# EasyEDA Pro project pcb_file.epro

# Schematic Schematic1
Board Name: Board1; Create Date: 2025-12-25; Page Name: P1; Project Name: 雷达扫描课设2.1; Schematic Name: Schematic1; Update Date: 2026-03-30; Company: 嘉立创EDA; Page Size: A4; Version: V1.0
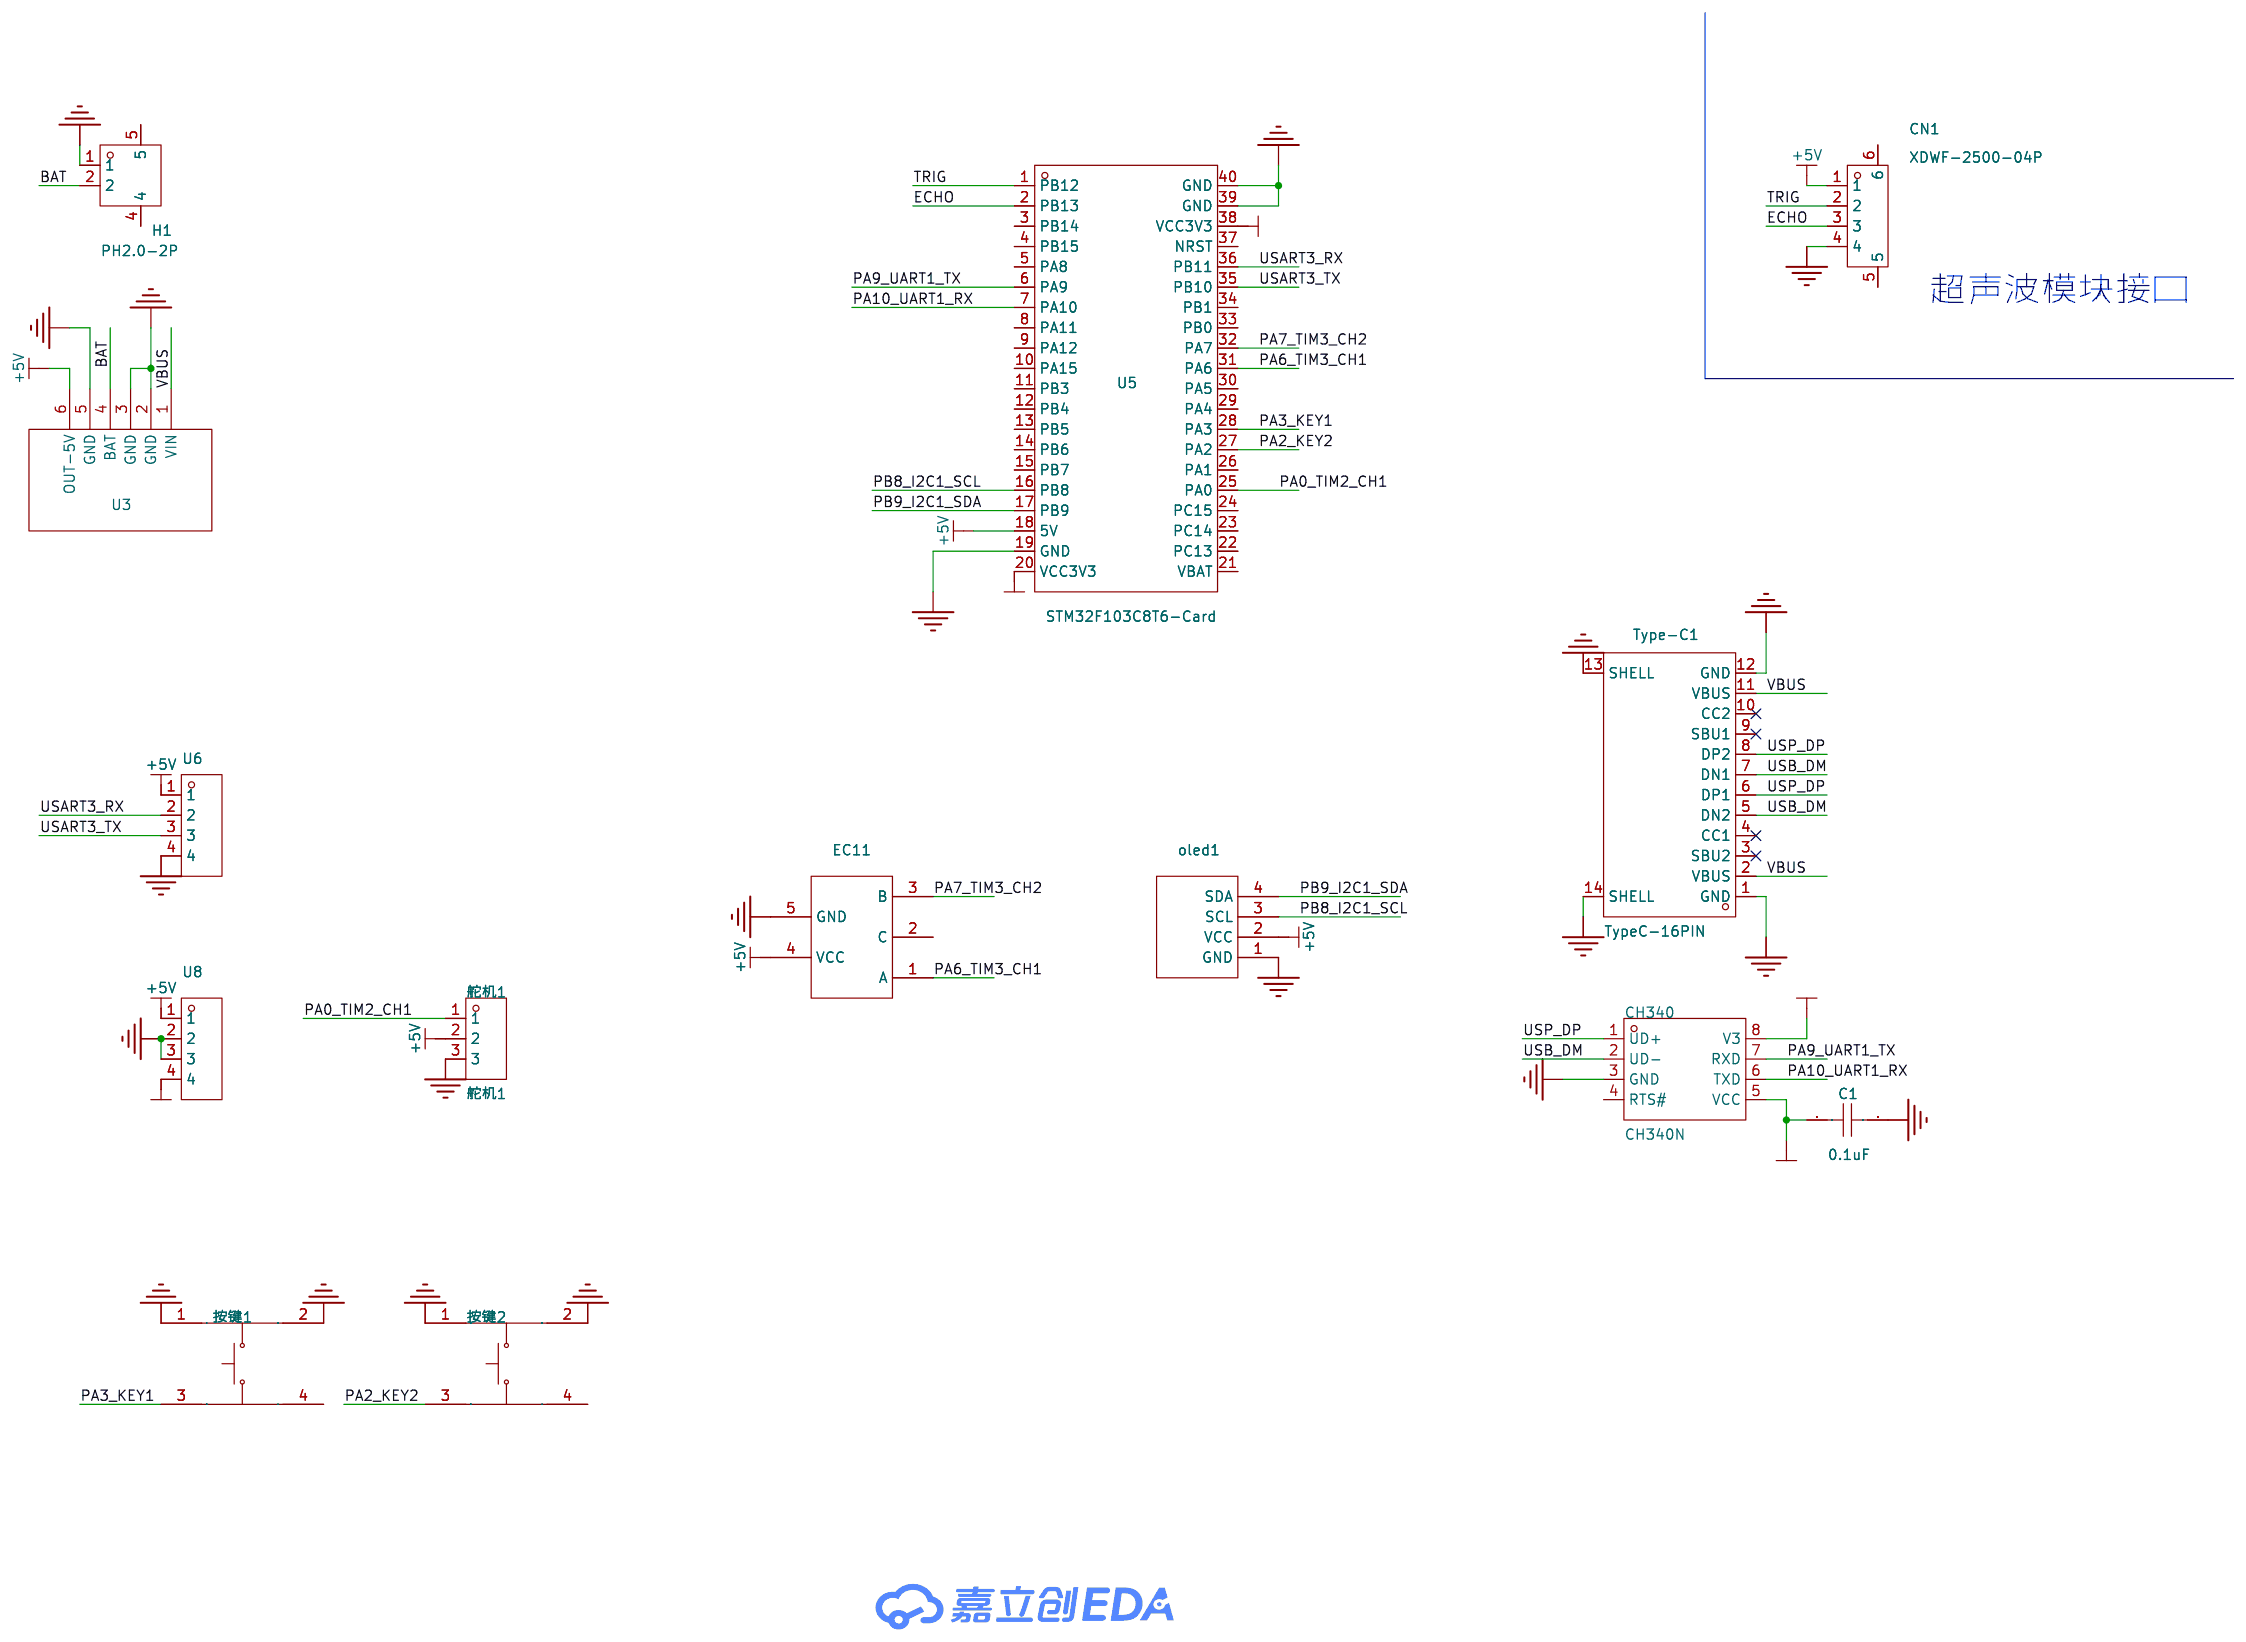
[diagram p0: schematic sheet]

## Parts
C1  0.1uF  [C0805]
CH340  CH340N  [SOP-8_L4.9-W3.9-P1.27-LS6.0-BL]
CN1  XDWF-2500-04P  [CONN-SMD_4P-P2.54_MXXH-2.54-04P-WT1-0-A]
EC11  -  [EC11封装]
H1  PH2.0-2P  [CONN-SMD_2P-P2.00_XUNPU_WAFER-PH2.0-2PWB]
oled1  -  [0.96 oled]
Type-C1  TypeC-16PIN  [USB-C-SMD_TYPE-C-6PIN-2MD-073]
U3  -  [充电板]
U5  STM32F103C8T6-Card  [CONN-TH_L53.3-W22.9_STM32F103C8T6-CARD]
U6  FG-PM2.54-1-04P-H8.5  [CONN-TH_FG-PM2.54-1-04P-H8.5]
U8  FG-PM2.54-1-04P-H8.5  [CONN-TH_FG-PM2.54-1-04P-H8.5]
按键1  TS5215A 250gf  [SW-SMD_4P-L5.2-W5.2-P3.70-LS6.4]
按键2  TS5215A 250gf  [SW-SMD_4P-L5.2-W5.2-P3.70-LS6.4]
舵机1  舵机1  [HDR-TH_3P-P2.54-V-M]

## Library data of the parts
C1 = CL21A226MAQNNNE: 容值:22uF;精度:±20%;额定电压:25V;材质(温度系数):X5R;; LCSC Part Name: 22uF ±20% 25V; Supplier Part: C45783; Manufacturer: SAMSUNG(三星); Supplier Footprint: 0805; JLCPCB Part Class: 基础库; Datasheet: https://atta.szlcsc.com/upload/public/pdf/source/20160218/1457707763339.pdf; Supplier: LCSC; Tolerance: ±20%; Voltage Rated: 25V; Temperature Coefficient: X5R
CH340 = CH340N: LCSC Part Name: USB转串口芯片 CH340; Supplier Part: C2977777; Manufacturer: WCH(南京沁恒); Supplier Footprint: SOP-8; JLCPCB Part Class: 扩展库; Datasheet: https://atta.szlcsc.com/upload/public/pdf/source/20230530/6E401E9554E9F5311886CC8B3F89B62E.pdf; Supplier: LCSC
CN1 = XDWF-2500-04P: 间距:2.54mm;安装方式:卧贴;参考系列:XH;总PIN数:4P;额定电流:4A;工作温度范围:-40℃~+85℃;; LCSC Part Name: 间距:2.54mm 卧贴 系列:XH; Supplier Part: C19723931; Manufacturer: LX(连欣科技); Supplier Footprint: SMD,P=2.5mm,卧贴; JLCPCB Part Class: 扩展库; Datasheet: https://atta.szlcsc.com/upload/public/pdf/source/20231222/6CB0E40CA6FFE63C5D87C69622E580AB.pdf; Supplier: LCSC; Pitch: 2.54mm; Mounting Style: 卧贴; Reference Series: XH; Number of Pins: 4P; Current Rating (Max): 4A; Operating Temperature Range: -40℃~+85℃
EC11 = EC11
H1 = WAFER-PH2.0-2PWB: 插针结构:1x2P;间距:2mm;安装方式:卧贴;总PIN数:2P;排数:1;每排PIN数:2;额定电流:2A;工作温度范围:-25℃~+85℃;; LCSC Part Name: 1x2P 间距:2mm 卧贴; Supplier Part: C3029440; Manufacturer: XUNPU(讯普); Supplier Footprint: SMD,P=2mm,卧贴; JLCPCB Part Class: 扩展库; Datasheet: https://atta.szlcsc.com/upload/public/pdf/source/20220527/83903C18429EFE4C9EEE8C529A248431.pdf; Supplier: LCSC; Pins Structure: 1x2P; Pitch: 2mm; Mounting Style: 卧贴; Number of Pins: 2P; Number of Rows: 1; Number of PINs Per Row: 2; Current Rating (Max): 2A; Operating Temperature Range: -25℃~+85℃
oled1 = oled
Type-C1 = TypeC-16PIN: Supplier Part: C9900016187; JLCPCB Part Class: 扩展库; Supplier: LCSC
U3 = 充电板
U5 = STM32F103C8T6-Card: Supplier Part: C9900077949; Supplier Footprint: 插件; Supplier: LCSC
U6 U8 = FG-PM2.54-1-04P-H8.5: 插孔结构:1x4P;间距:2.54mm;圆孔/方孔:方孔;安装方式:直插;排数:单排;总孔位数:4P;额定电流:3A;插孔方向:顶部;塑高:8.5mm;触头材质:黄铜;; LCSC Part Name: 间距:2.54mm 1x4P 直插; Supplier Part: C25687186; Manufacturer: FG(富港); Supplier Footprint: 插件,P=2.54mm; JLCPCB Part Class: 扩展库; Datasheet: https://item.szlcsc.com/datasheet/FG-PM2.54-1-04P-H8.5/27570630.html; Supplier: LCSC; Holes Structure: 1x4P; Pitch: 2.54mm; Circular Hole / Square Hole: 方孔; Mounting Type: 直插; Number of Rows: 单排; Number of Positions: 4P; Current Rating: 3A; Holes Direction: 顶部; Insulation Height: 8.5mm; Contact Material: 黄铜
按键1 按键2 = TS5215A 250gf: 电路结构:单刀单掷;按钮形状:圆形按钮;安装方式:立贴;开关长度:5.2mm;开关宽度:5.2mm;触点电流:50mA;额定电压(DC):12V;带灯:-;机械寿命:-;; LCSC Part Name: 轻触开关 5.2*5.2*1.5mm 250gf 4*4铜头; Supplier Part: C388295; Manufacturer: SHOU HAN(首韩); Supplier Footprint: SMD; JLCPCB Part Class: 扩展库; Datasheet: https://atta.szlcsc.com/upload/public/pdf/source/20190424/C388295_31A82B96127B687D36F6ABA2DD1EA95B.pdf; Supplier: LCSC; Circuit: 单刀单掷; Actuator Style: 圆形按钮; Mounting Style: 立贴; Switch Length: 5.2mm; Switch Width: 5.2mm; Contact Current: 50mA; Voltage Rating (DC): 12V
舵机1 = PZ254V-11-03P: 插针结构:1x3P;间距:2.54mm;行距:-;圆针/方针:方针;安装方式:直插;排数:单排;总PIN位数:3P;额定电流:3A;额定电压:250V;配合针长度:6mm;塑高:2.5mm;端接针长度:3mm;工作温度:-40℃~+105℃;颜色:黑色;; LCSC Part Name: 1x3P 间距:2.54mm 方针 直插; Supplier Part: C2937625; Manufacturer: XFCN(兴飞); Supplier Footprint: 插件,P=2.54mm; JLCPCB Part Class: 扩展库; Datasheet: https://atta.szlcsc.com/upload/public/pdf/source/20200309/C492402_8335C3D49C4E4C618838D59BB1D024C1.pdf; Supplier: LCSC; Pin Structure: 1x3P; Pitch: 2.54mm; Circluar Pins/Square Pins: 方针; Mounting Type: 直插; Number of Rows: 单排; Number of Pins: 3P; Current Rating: 3A; Voltage Rating (Max): 250V; Length of Mating Pin: 6mm; Insulation Height: 2.5mm; Length of End Connection Pin: 3mm; Operating Temperature: -40℃~+105℃; Color: 黑色; Current Rating (Max): 3A; Operating Temperature Range: -40℃~+105℃

## Nets
3V3: C1.1 CH340.5(VCC) CH340.8(V3) U5.20(VCC3V3) U5.38(VCC3V3) U8.4
+5V: CN1.1 EC11.4(VCC) oled1.2(VCC) U3.6(OUT-5V) U5.18(5V) U6.1 U8.1 舵机1.2
GND: C1.2 CH340.3(GND) CN1.4 EC11.5(GND) H1.1 oled1.1(GND) Type-C1.1(GND) Type-C1.12(GND) Type-C1.13(SHELL) Type-C1.14(SHELL) U3.2(GND) U3.3(GND) U3.5(GND) U5.19(GND) U5.39(GND) U5.40(GND) U6.4 U8.2 U8.3 按键1.1 按键1.2 按键2.1 按键2.2 舵机1.3
VBUS: Type-C1.2(VBUS) Type-C1.11(VBUS) U3.1(VIN)
BAT: H1.2 U3.4(BAT)
ECHO: CN1.3 U5.2(PB13)
PA0_TIM2_CH1: U5.25(PA0) 舵机1.1
PA2_KEY2: U5.27(PA2) 按键2.3
PA3_KEY1: U5.28(PA3) 按键1.3
PA6_TIM3_CH1: EC11.1(A) U5.31(PA6)
PA7_TIM3_CH2: EC11.3(B) U5.32(PA7)
PA9_UART1_TX: CH340.7(RXD) U5.6(PA9)
PA10_UART1_RX: CH340.6(TXD) U5.7(PA10)
PB8_I2C1_SCL: oled1.3(SCL) U5.16(PB8)
PB9_I2C1_SDA: oled1.4(SDA) U5.17(PB9)
TRIG: CN1.2 U5.1(PB12)
USART3_RX: U5.36(PB11) U6.2
USART3_TX: U5.35(PB10) U6.3
USB_DM: CH340.2(UD-) Type-C1.5(DN2) Type-C1.7(DN1)
USP_DP: CH340.1(UD+) Type-C1.6(DP1) Type-C1.8(DP2)

Not connected (* = marked no-connect by the designer): CH340 4(RTS#); CN1 5 6; EC11 2(C); H1 4 5; Type-C1 3(SBU2)* 4(CC1)* 9(SBU1)* 10(CC2)*; U5 3(PB14) 4(PB15) 5(PA8) 8(PA11) 9(PA12) 10(PA15) 11(PB3) 12(PB4) 13(PB5) 14(PB6) 15(PB7) 21(VBAT) 22(PC13) 23(PC14) 24(PC15) 26(PA1) 29(PA4) 30(PA5) 33(PB0) 34(PB1) 37(NRST); 按键1 4; 按键2 4

## Notes on the sheet
- 超声波模块接口

# Board PCB1
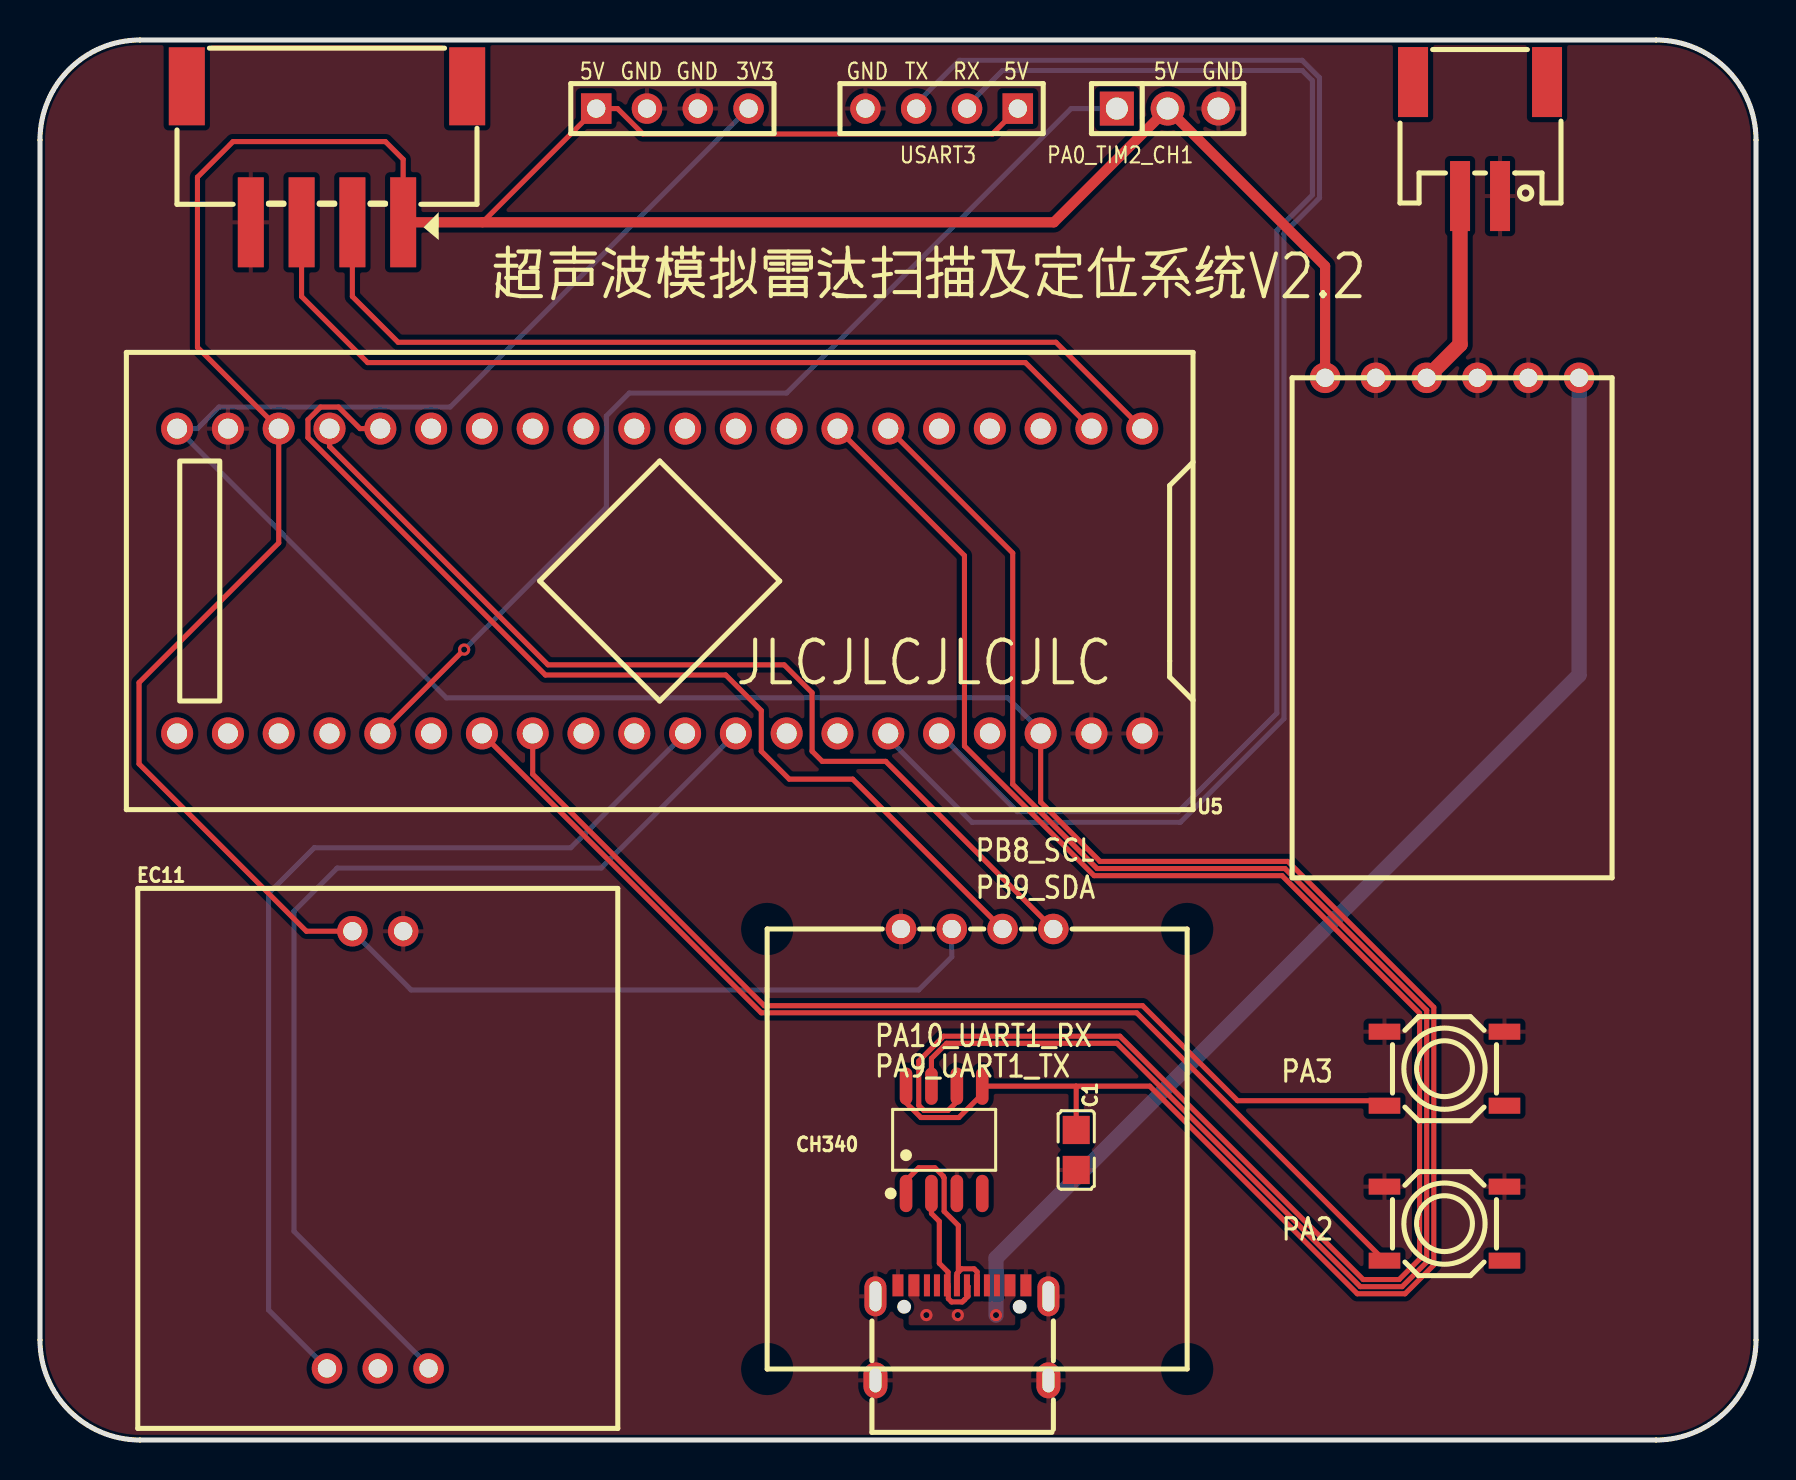
[diagram p1: board, top side]
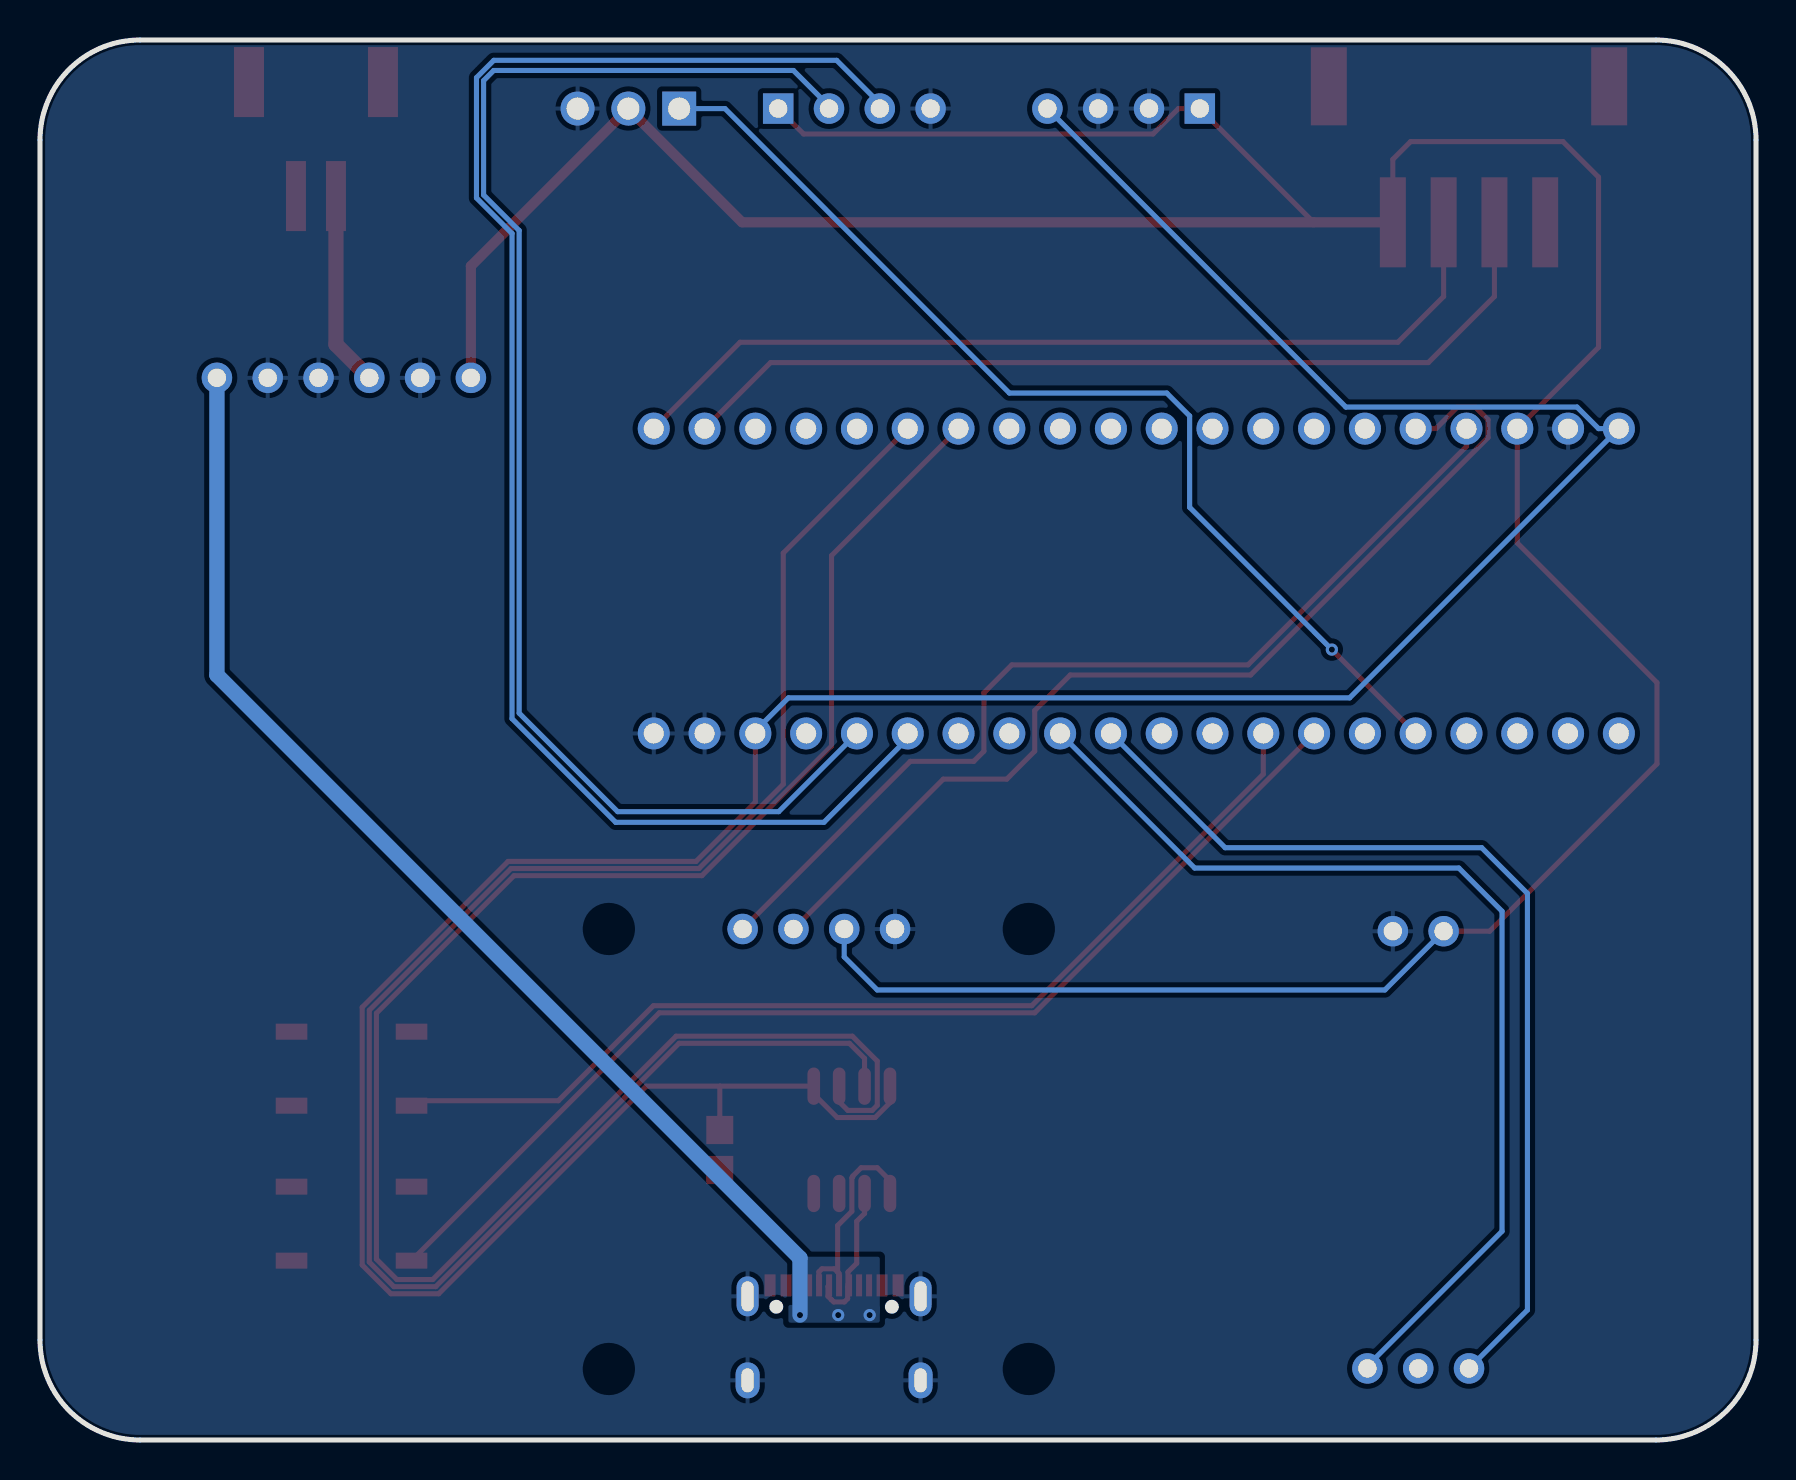
[diagram p2: board, bottom side, seen from below]

Outline 85.81 x 70 mm; copper layers: Top Layer, Bottom Layer. Coordinates in mm from the lower left corner of the outline.
Outline path: 0,65 0,5 arc(1.46,1.46) 5,0 80.81,0 arc(84.34,1.46) 85.81,5 85.81,65 arc(84.34,68.54) 80.81,70 5,70 arc(1.46,68.54) 0,65
Stack: Top Layer 0.035mm / Dielectric1 1.51mm FR4 er 4.5 / Bottom Layer 0.035mm

## Design rules (mm)
template: 自定义配置
spacing copperThickness1oz (default): track to track 0.102, other pairs 0.152 to 0.3
spacing copperThickness2oz: track to track 0.203, other pairs 0.152 to 0.3
track width copperThickness1oz (default): min 0.127, default 0.254, max 2.54
track width copperThickness2oz: min 0.203, default 0.254, max 2.54
differential pair differentialPair (default): width min 0.127, default 0.254, max 2.54; gap min 0.152, default 0.152
via viaSize (default): diameter min 0.5, default 0.61, max 10; hole min 0.3, default 0.305, max 6.3
net VBUS uses new_rule

## Placement (name value [footprint] x y rotation side)
C1  0.1uF  [C0805]  51.82 14.5 270 top
CH340  CH340N  [SOP-8_L4.9-W3.9-P1.27-LS6.0-BL]  45.21 15.01 0 top
CN1  XDWF-2500-04P  [CONN-SMD_4P-P2.54_MXXH-2.54-04P-WT1-0-A]  14.35 64.29 180 top
EC11  -  [EC11封装]  16.89 3.58 0 top
H1  PH2.0-2P  [CONN-SMD_2P-P2.00_XUNPU_WAFER-PH2.0-2PWB]  72.01 65.05 180 top
oled1  -  [0.96 oled]  46.86 25.55 0 top
Type-C1  TypeC-16PIN  [USB-C-SMD_TYPE-C-6PIN-2MD-073]  46.1 5.36 0 top
U3  -  [充电板]  70.61 53.11 0 top
U5  STM32F103C8T6-Card  [CONN-TH_L53.3-W22.9_STM32F103C8T6-CARD]  30.99 42.95 180 top
U6  FG-PM2.54-1-04P-H8.5  [CONN-TH_FG-PM2.54-1-04P-H8.5]  45.08 66.57 180 top
U8  FG-PM2.54-1-04P-H8.5  [CONN-TH_FG-PM2.54-1-04P-H8.5]  31.62 66.57 0 top
按键1  TS5215A 250gf  [SW-SMD_4P-L5.2-W5.2-P3.70-LS6.4]  70.23 18.57 0 top
按键2  TS5215A 250gf  [SW-SMD_4P-L5.2-W5.2-P3.70-LS6.4]  70.23 10.82 0 top
舵机1  舵机1  [HDR-TH_3P-P2.54-V-M]  56.39 66.57 0 top

## Footprints (pads in the part's own frame, mm; a bottom-side part is the same pattern mirrored in y, then rotated)
0.96 oled
  round 1.524 hole 0.914: 1(-3.81,0) 2(-1.27,0) 3(1.27,0) 4(3.81,0)
C0805
  rect 1.41x1.35 smd: 1(-1,0) 2(1,0)
CONN-SMD_2P-P2.00_XUNPU_WAFER-PH2.0-2PWB
  rect 1x3.5 smd: 1(-1,2.85) 2(1,2.85)
  rect 1.5x3.5 smd: 4(3.35,-2.85) 5(-3.35,-2.85)
CONN-SMD_4P-P2.54_MXXH-2.54-04P-WT1-0-A
  rect 1.3x4.5 smd: 1(-3.809,3.4) 2(-1.27,3.4) 3(1.27,3.4) 4(3.81,3.4)
  rect 1.8x3.9 smd: 5(7.01,-3.4) 6(-7.01,-3.4)
CONN-TH_FG-PM2.54-1-04P-H8.5
  rect 1.524x1.524 hole 0.914: 1(-3.81,0)
  round 1.524 hole 0.914: 2(-1.27,0) 3(1.27,0) 4(3.81,0)
CONN-TH_L53.3-W22.9_STM32F103C8T6-CARD
  round 1.6 hole 1: 1(-24.13,-7.62) 2(-21.59,-7.62) 3(-19.05,-7.62) 4(-16.51,-7.62) 5(-13.97,-7.62) 6(-11.43,-7.62) 7(-8.89,-7.62) 8(-6.35,-7.62) 9(-3.81,-7.62) 10(-1.27,-7.62) 11(1.27,-7.62) 12(3.81,-7.62) 13(6.35,-7.62) 14(8.89,-7.62) 15(11.43,-7.62) 16(13.97,-7.62) 17(16.51,-7.62) 18(19.05,-7.62) 19(21.59,-7.62) 20(24.13,-7.62) 21(24.13,7.62) 22(21.59,7.62) 23(19.05,7.62) 24(16.51,7.62) 25(13.97,7.62) 26(11.43,7.62) 27(8.89,7.62) 28(6.35,7.62) 29(3.81,7.62) 30(1.27,7.62) 31(-1.27,7.62) 32(-3.81,7.62) 33(-6.35,7.62) 34(-8.89,7.62) 35(-11.43,7.62) 36(-13.97,7.62) 37(-16.51,7.62) 38(-19.05,7.62) 39(-21.59,7.62) 40(-24.13,7.62)
EC11封装
  round 1.524 hole 0.914: 1(-2.54,0) 2(0,0) 3(2.54,0) 4(-1.27,21.86) 5(1.27,21.86)
HDR-TH_3P-P2.54-V-M
  rect 1.7x1.7 hole 1.1: 1(-2.54,0)
  round 1.7 hole 1.1: 2(0,0) 3(2.54,0)
SOP-8_L4.9-W3.9-P1.27-LS6.0-BL
  oval 0.63x1.865 smd: 1(-1.905,-2.683) 2(-0.635,-2.683) 3(0.635,-2.683) 4(1.905,-2.683) 5(1.905,2.683) 6(0.635,2.683) 7(-0.635,2.683) 8(-1.905,2.683)
SW-SMD_4P-L5.2-W5.2-P3.70-LS6.4
  rect 1.58x0.8 smd: 1(-3,1.85) 2(3,1.85) 3(-3,-1.85) 4(3,-1.85)
USB-C-SMD_TYPE-C-6PIN-2MD-073
  rect 0.55x1.1 smd: 1(-3.2,2.375) 2(-2.4,2.375) 11(2.4,2.375) 12(3.2,2.375)
  rect 0.3x1.1 smd: 3(-1.75,2.375) 4(-1.25,2.375) 5(-0.75,2.375) 6(-0.25,2.375) 7(0.25,2.375) 8(0.75,2.375) 9(1.25,2.375) 10(1.75,2.375)
  oval 1.1x2 hole 0.6x1.5: 13(-4.325,1.825) 14(4.325,1.825)
  oval 1.2x1.8 hole 0.6x1.2: 13(-4.325,-2.375) 14(4.325,-2.375)
充电板
  round 1.524 hole 0.914: 1(6.35,0) 2(3.81,0) 3(1.27,0) 4(-1.27,0) 5(-3.81,0) 6(-6.35,0)

## Nets
As in the schematic.

Pads without a net: CH340 4; CN1 5 6; EC11 2; H1 4 5; Type-C1 3 4 9 10; U5 3 4 5 8 9 10 11 12 13 14 15 21 22 23 24 26 29 30 33 34 37; 按键1 4; 按键2 4

## Via types
v1: diameter 0.61, hole 0.305, Top Layer to Bottom Layer, 4 vias

## Routing (per net, layer and track width the routed paths; a pad name or vN(x,y) marks a point on that pad's centre or on a via; arc(x,y) is an arc through that point)
3V3: length 160.5
  Top Layer w0.254: 51.8,17.69 55.49,17.69 65.87,7.31 68.26,7.31 69.7,8.75 69.7,21.63 62.4,28.93 53,28.93 50.04,31.9 U5.38 ; 51.8,17.69 CH340.5 47.12,17.3 45.95,16.12 44.05,16.12 43.31,16.87 CH340.8 ; 51.8,17.69 51.82,17.68 C1.1
  Bottom Layer w0.254: U5.38 50.04,35.46 48.39,37.11 20.32,37.11 U5.20 7.87,50.57 8.95,51.65 20.51,51.65 U8.4
+5V: length 183.3
  Top Layer w0.254: 22.13,60.89 U8.1 28.88,66.57 30.15,65.3 47.63,65.3 U6.1 ; CN1.1 18.16,64.03 17.27,64.92 9.65,64.92 7.87,63.14 7.87,54.63 U5.18 11.94,44.85 4.95,37.87 4.95,33.81 13.32,25.44 EC11.4
  Top Layer w0.508: CN1.1 50.7,60.89 舵机1.2 64.26,58.7 U3.6
  Bottom Layer w0.254: EC11.4 18.56,22.5 43.94,22.5 45.59,24.15 oled1.2
VBUS: length 58.9
  Bottom Layer w0.762: v1(47.81,6.25) 47.81,9.09 76.96,38.25 U3.1
  vias: v1(44.32,6.25) v1(45.89,6.25)
BAT: length 9.8
  Top Layer w0.762: H1.2 71.01,54.78 U3.4
ECHO: length 45.9
  Top Layer w0.254: CN1.3 13.08,57.17 16.38,53.87 49.28,53.87 U5.2
PA0_TIM2_CH1: length 52.4
  Top Layer w0.254: U5.25 v1(21.21,39.52)
  Bottom Layer w0.254: v1(21.21,39.52) 28.32,46.63 28.32,51.2 29.46,52.35 37.33,52.35 51.56,66.57 舵机1.1
PA2_KEY2: length 56.1
  Top Layer w0.254: 按键2.3 54.84,21.36 36.07,21.36 U5.27
PA3_KEY1: length 51.5
  Top Layer w0.254: 67.23,16.72 66.98,16.96 59.89,16.96 55.14,21.72 36.22,21.72 24.64,33.29 U5.28
PA6_TIM3_CH1: length 49.1
  Bottom Layer w0.254: EC11.1 11.43,6.5 11.43,27.33 13.72,29.61 26.54,29.61 U5.31
PA7_TIM3_CH2: length 51.3
  Bottom Layer w0.254: U5.32 28.07,28.6 14.86,28.6 12.7,26.44 12.7,10.44 19.43,3.71
PA9_UART1_TX: length 90.3
  Top Layer w0.254: CH340.7 44.58,19.08 45.33,19.84 53.85,19.84 66.02,7.67 68.11,7.67 69.34,8.9 69.34,21.49 62.26,28.57 52.86,28.57 48.64,32.79 48.64,44.35 U5.6
PA10_UART1_RX: length 95.3
  Top Layer w0.254: U5.7 46.23,44.22 46.23,34.7 52.71,28.22 62.11,28.22 68.99,21.34 68.99,9.04 67.97,8.02 66.17,8.02 54,20.19 45.19,20.19 43.94,18.95 43.94,16.73 44.2,16.48 45.41,16.48 45.85,16.91 CH340.6
PB8_I2C1_SCL: length 51.3
  Top Layer w0.254: oled1.3 40.64,33.04 37.46,33.04 36.07,34.44 36.07,36.47 34.29,38.25 25.27,38.25 13.4,50.12 13.4,51.02 14.03,51.65 14.92,51.65 16,50.57 U5.16
PB9_I2C1_SDA: length 48.8
  Top Layer w0.254: U5.17 14.48,49.68 25.4,38.76 37.21,38.76 38.61,37.36 38.61,34.44 39.12,33.93 42.29,33.93 oled1.4
TRIG: length 45.9
  Top Layer w0.254: CN1.2 15.62,57.17 17.91,54.89 50.8,54.89 U5.1
USART3_RX: length 71.3
  Bottom Layer w0.254: U6.2 46.36,66.7 48.13,68.48 63.12,68.48 63.63,67.97 63.63,62.25 61.85,60.48 61.85,36.35 56.92,31.42 48.87,31.42 U5.36
USART3_TX: length 78.4
  Bottom Layer w0.254: U5.35 42.42,35.08 46.61,30.88 57.02,30.88 62.2,36.07 62.2,60.33 63.98,62.11 63.98,68.12 63.11,68.98 45.97,68.98 43.82,66.83 U6.3
USB_DM: length 7.4
  Top Layer w0.254: CH340.2 44.58,11.33 44.97,10.93 44.97,8.83 45.41,8.4 45.41,7.79 Type-C1.5 45.42,7.66 45.42,7.07 45.59,6.9 46.12,6.9 46.22,7.01 46.23,7.01 46.41,7.19 46.41,7.68 Type-C1.7
USP_DP: length 10.5
  Top Layer w0.254: CH340.1 43.31,12.98 43.94,13.61 44.75,13.61 45.17,13.19 45.17,13.15 45.21,13.1 45.21,11.43 45.92,10.72 45.92,8.4 ; 45.92,8.4 46.09,8.56 46.71,8.56 46.86,8.41 46.86,7.74 Type-C1.8 ; 45.92,8.4 45.85,8.33 Type-C1.6

## Copper pours and planes (outline as drawn; the poured copper is in the pictures)
GND on Top Layer: -3.81,73.56 90.93,73.56 90.93,-2.52 -3.81,-2.52
GND on Bottom Layer: -4.06,71.91 89.15,71.91 89.15,-2.39 -4.06,-2.39
VBUS on Top Layer: 43.43,8.28 48.77,8.28 48.77,5.74 43.43,5.74
VBUS on Bottom Layer: 43.82,6.75 48.39,6.75 48.39,5.87 43.82,5.87
VBUS on Bottom Layer: 43.82,9.17 48.11,9.17 48.11,6.25 43.82,6.25

## Text on the board
Top Silkscreen Layer: 5V | GND | 3V3 | USART3 | TX | RX | PA0_TIM2_CH1 | PA10_UART1_RX | PA9_UART1_TX | PB8_SCL | PB9_SDA | PA3 | PA2 | JLCJLCJLCJLC | 超声波模拟雷达扫描及定位系统V2.2
